# EAGLE design PCB2 (EAGLE 7.5.0)
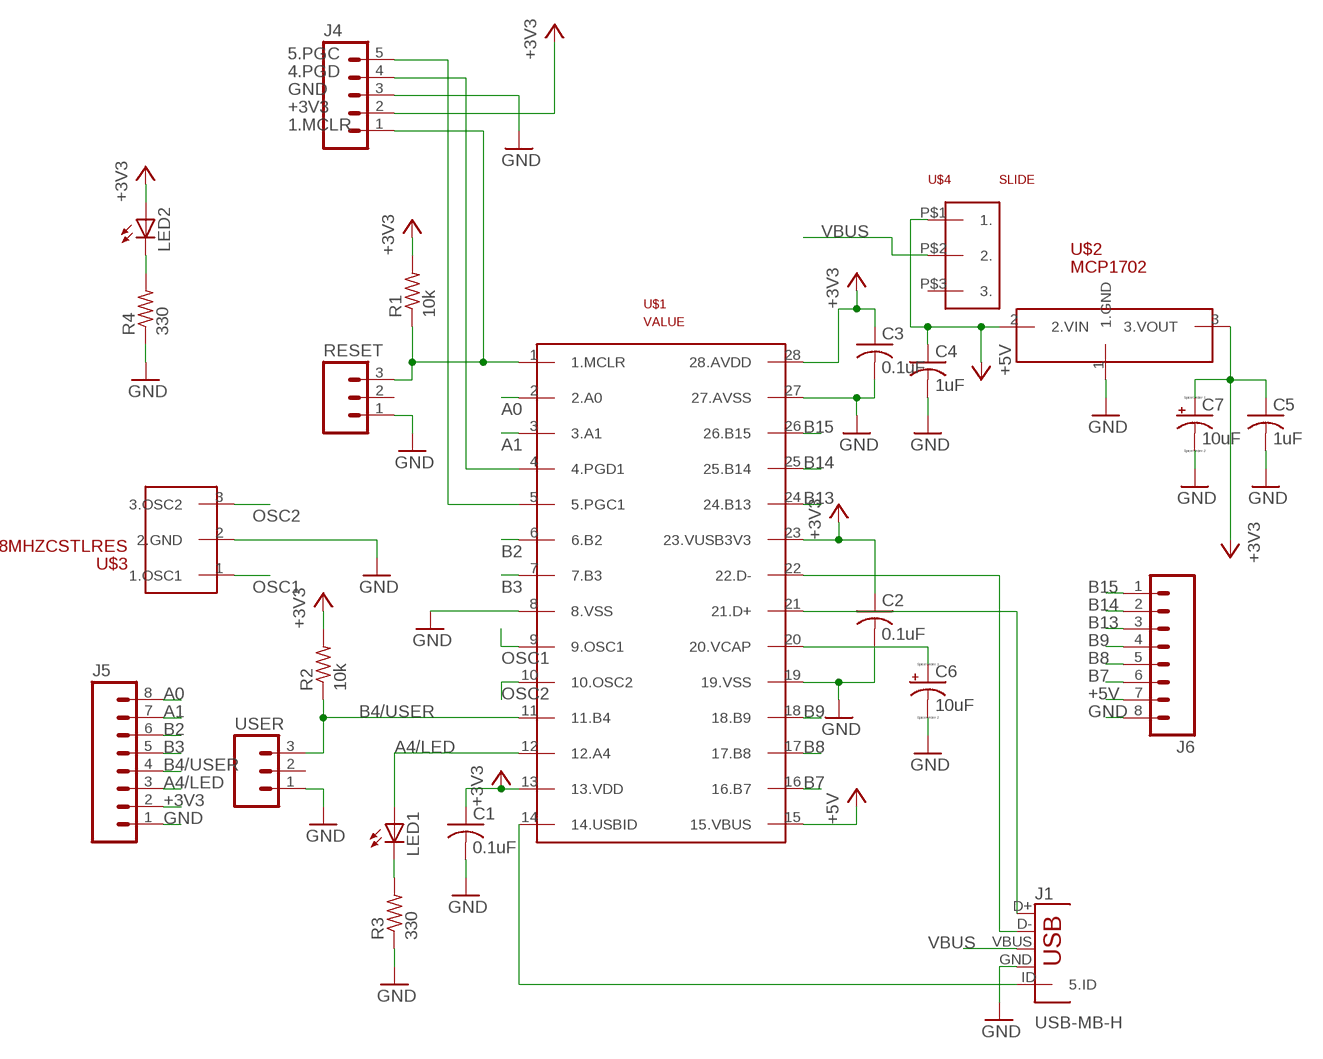
[diagram p0: schematic, sheet 1]

## Parts
C1  0.1uF  C-US025-024X044  [C025-024X044]
C2  0.1uF  C-US025-024X044  [C025-024X044]
C3  0.1uF  C-US025-024X044  [C025-024X044]
C4  1uF  C-US050-024X044  [C050-024X044]
C5  1uF  C-US050-024X044  [C050-024X044]
C6  10uF  CPOL-USTAP5-50  [TAP5-50]
C7  10uF  CPOL-USTAP5-50  [TAP5-50]
J1  USB-MB-H  [USB-MB-H]
J4  M05PTH  [1X05]
J5  M08  [1X08_ROUND]
J6  M08  [1X08_ROUND]
LED1  LED3MM  [LED3MM]
LED2  LED3MM  [LED3MM]
R1  10k  R-US_0207/10  [0207/10]
R2  10k  R-US_0207/10  [0207/10]
R3  330  R-US_0207/10  [0207/10]
R4  330  R-US_0207/10  [0207/10]
RESET  M03PTH  [1X03]
U$1  PIC32MX250F128B  [DIL28-3]
U$2  MCP1702  [TO92]
U$3  8MHZCSTLRES  [1X03]
U$4  SLIDE  [SLIDE]
USER  M03PTH  [1X03]

## Nets
1.MCLR: J4.1 R1.1 RESET.3 U$1.1(1.MCLR)
4.PGD: J4.4 U$1.4(4.PGD1)
5.PGC: J4.5 U$1.5(5.PGC1)
+3V3: C1.1 C2.1 C3.1 C5.1 C7.+ J4.2 J5.2 LED2.A R1.2 R2.2 U$1.13(13.VDD) U$1.23(23.VUSB3V3) U$1.28(28.AVDD) U$2.3(3.VOUT)
+5V: C4.1 J6.7 U$1.15(15.VBUS) U$2.2(2.VIN) U$4.P$1(1.)
A0: J5.8 U$1.2(2.A0)
A1: J5.7 U$1.3(3.A1)
A4/LED: J5.3 LED1.A U$1.12(12.A4)
B2: J5.6 U$1.6(6.B2)
B3: J5.5 U$1.7(7.B3)
B4/USER: J5.4 R2.1 U$1.11(11.B4) USER.3
B7: J6.6 U$1.16(16.B7)
B8: J6.5 U$1.17(17.B8)
B9: J6.4 U$1.18(18.B9)
B13: J6.3 U$1.24(24.B13)
B14: J6.2 U$1.25(25.B14)
B15: J6.1 U$1.26(26.B15)
GND: C1.2 C2.2 C3.2 C4.2 C5.2 C6.- C7.- J1.GND J4.3 J5.1 J6.8 R3.1 R4.1 RESET.1 U$1.8(8.VSS) U$1.19(19.VSS) U$1.27(27.AVSS) U$2.1(1.GND) U$3.2(2.GND) USER.1
N$2: LED1.K(C) R3.2
N$3: J1.ID(5.ID) U$1.14(14.USBID)
N$7: J1.D- U$1.22(22.D-)
N$8: J1.D+ U$1.21(21.D+)
N$10: C6.+ U$1.20(20.VCAP)
N$11: LED2.K(C) R4.2
OSC1: U$1.9(9.OSC1) U$3.1(1.OSC1)
OSC2: U$1.10(10.OSC2) U$3.3(3.OSC2)
VBUS: J1.VBUS U$4.P$2(2.)
Unconnected: RESET.2 U$4.P$3(3.) USER.2

## Library data of the parts
C1-C5 = PCB:C-US: CAPACITOR, American symbol
C6 C7 = PCB:CPOL-US: POLARIZED CAPACITOR, American symbol
J1 = PCB:USB: USB Connectors USB-B-PTH is fully proven SKU : PRT-00139/CONN-08278 USB-miniB is fully proven SKU : PRT-00587 USB-A-PCB is untested. USB-A-H is throughly reviewed, but untested. Spark Fun Electronics SKU : PRT-00437 USB-B-SMT is throughly reviewed, but untested. Needs silkscreen touching up. USB-A-S has not been used/tested USB-MB-H has not been used/tested USB-MICROB has been used. CONN-09505
J4 = PCB:M05: Header 5 Standard 5-pin 0.1" header. Use with straight break away headers (SKU : PRT-00116), right angle break away headers (PRT-00553), swiss pins (PRT-00743), machine pins (PRT-00117), and female headers (PRT-00115). Molex polarized connector foot print use with SKU : PRT-08230 with associated crimp pins and housings.
J5 J6 = PCB:M08: Header 8 Standard 8-pin 0.1" header. Use with straight break away headers (SKU : PRT-00116), right angle break away headers (PRT-00553), swiss pins (PRT-00743), machine pins (PRT-00117), and female headers (PRT-00115).; PROD_ID: CONN-08437
LED1 LED2 = PCB:LED: LED OSRAM: - CHIPLED LG R971, LG N971, LY N971, LG Q971, LY Q971, LO R971, LY R971 LH N974, LH R974 LS Q976, LO Q976, LY Q976 LO Q996 - Hyper CHIPLED LW Q18S LB Q993, LB Q99A, LB R99A - SideLED LS A670, LO A670, LY A670, LG A670, LP A670 LB A673, LV A673, LT A673, LW A673 LH A674 LY A675 LS A676, LA A676, LO A676, LY A676, LW A676 LS A679, LY A679, LG A679 - Hyper Micro SIDELED® LS Y876, LA Y876, LO Y876, LY Y876 LT Y87S - SmartLED LW L88C, LW L88S LB L89C, LB L89S, LG L890 LS L89K, LO L89K, LY L89K LS L896, LA L896, LO L896, LY L896 - TOPLED LS T670, LO T670, LY T670, LG T670, LP T670 LSG T670, LSP T670, LSY T670, LOP T670, LYG T670 LG T671, LOG T671, LSG T671 LB T673, LV T673, LT T673, LW T673 LH T674 LS T676, LA T676, LO T676, LY T676, LB T676, LH T676, LSB T676, LW T676 LB T67C, LV T67C, LT T67C, LS T67K, LO T67K, LY T67K, LW E67C LS E67B, LA E67B, LO E67B, LY E67B, LB E67C, LV E67C, LT E67C LW T67C LS T679, LY T679, LG T679 LS T770, LO T770, LY T770, LG T770, LP T770 LB T773, LV T773, LT T773, LW T773 LH T774 LS E675, LA E675, LY E675, LS T675 LS T776, LA T776, LO T776, LY T776, LB T776 LHGB T686 LT T68C, LB T68C - Hyper Mini TOPLED® LB M676 - Mini TOPLED Santana® LG M470 LS M47K, LO M47K, LY M47K Source: http://www.osram.convergy.de LUXEON: - LUMILED® LXK2-PW12-R00, LXK2-PW12-S00, LXK2-PW14-U00, LXK2-PW14-V00 LXK2-PM12-R00, LXK2-PM12-S00, LXK2-PM14-U00 LXK2-PE12-Q00, LXK2-PE12-R00, LXK2-PE12-S00, LXK2-PE14-T00, LXK2-PE14-U00 LXK2-PB12-K00, LXK2-PB12-L00, LXK2-PB12-M00, LXK2-PB14-N00, LXK2-PB14-P00, LXK2-PB14-Q00 LXK2-PR12-L00, LXK2-PR12-M00, LXK2-PR14-Q00, LXK2-PR14-R00 LXK2-PD12-Q00, LXK2-PD12-R00, LXK2-PD12-S00 LXK2-PH12-R00, LXK2-PH12-S00 LXK2-PL12-P00, LXK2-PL12-Q00, LXK2-PL12-R00 Source: www.luxeon.com KINGBRIGHT: KA-3528ASYC Source: www.kingbright.com
R1-R4 = PCB:R-US_: RESISTOR, American symbol
RESET USER = PCB:M03: Header 3 Standard 3-pin 0.1" header. Use with straight break away headers (SKU : PRT-00116), right angle break away headers (PRT-00553), swiss pins (PRT-00743), machine pins (PRT-00117), and female headers (PRT-00115). Molex polarized connector foot print use with SKU : PRT-08232 with associated crimp pins and housings.
U$1 = PCB:PIC32MX250F128B
U$2 = PCB:MCP1702
U$3 = PCB:8MHZCSTLRES
U$4 = PCB:SLIDE

## Board
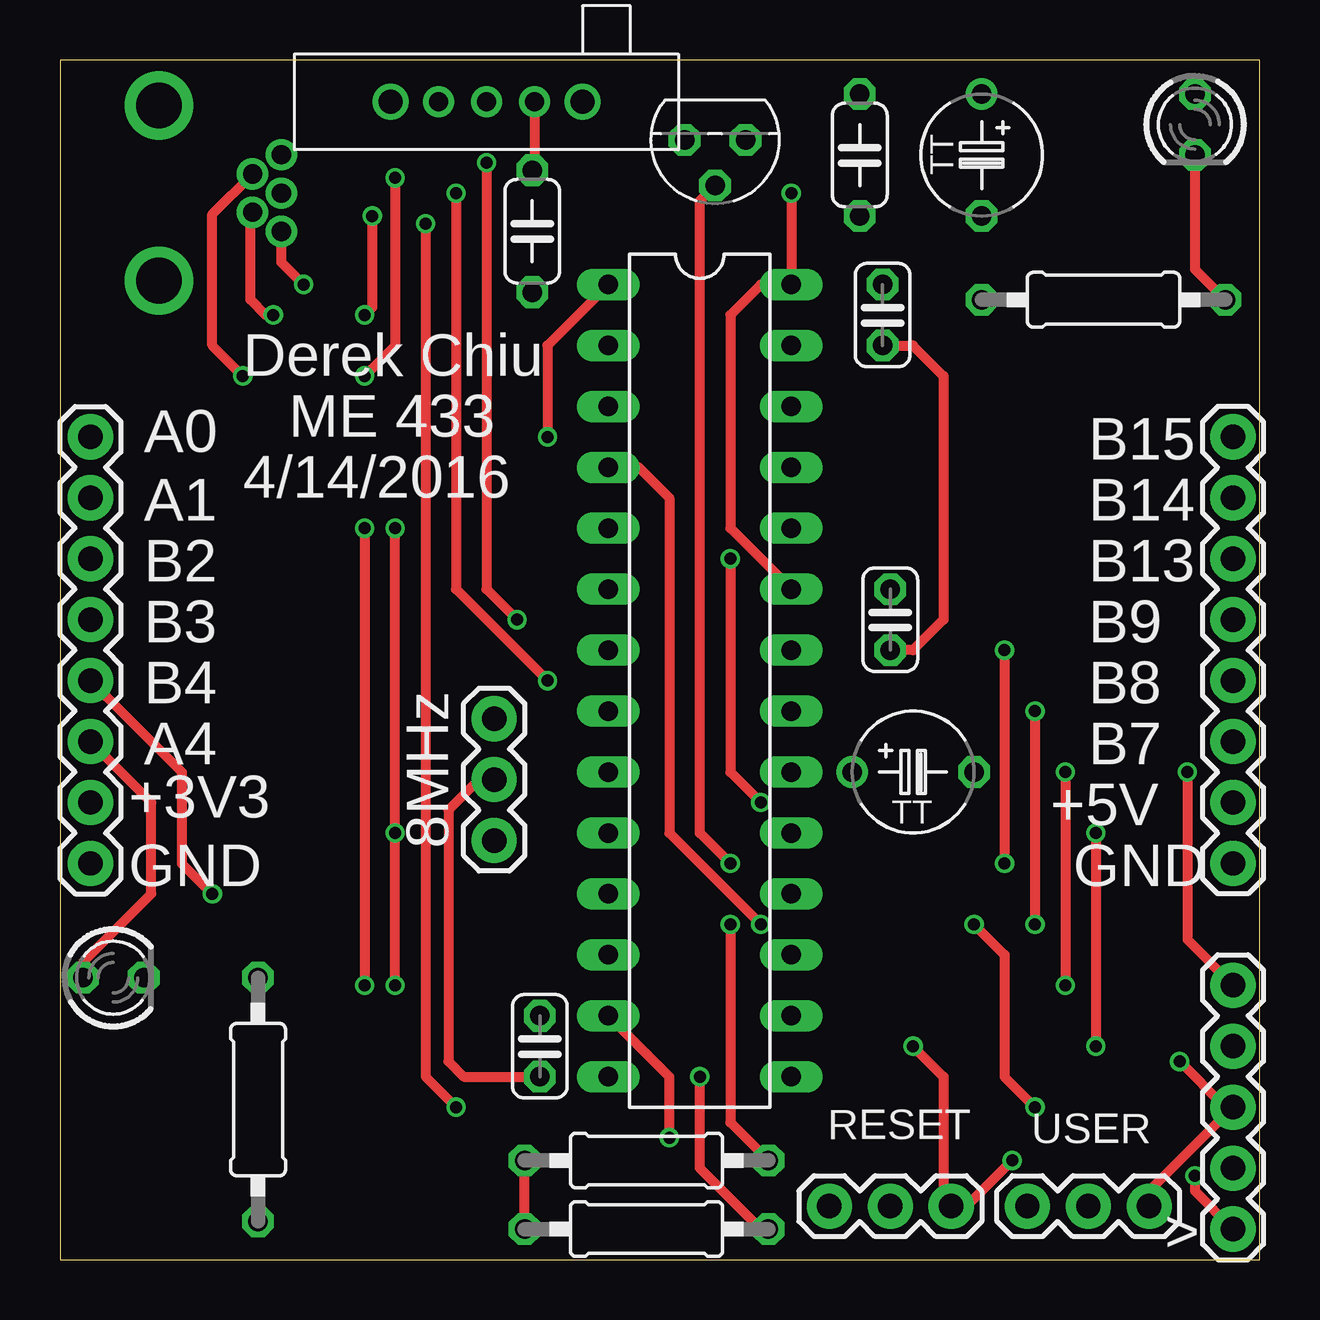
[diagram p1: board, top side]
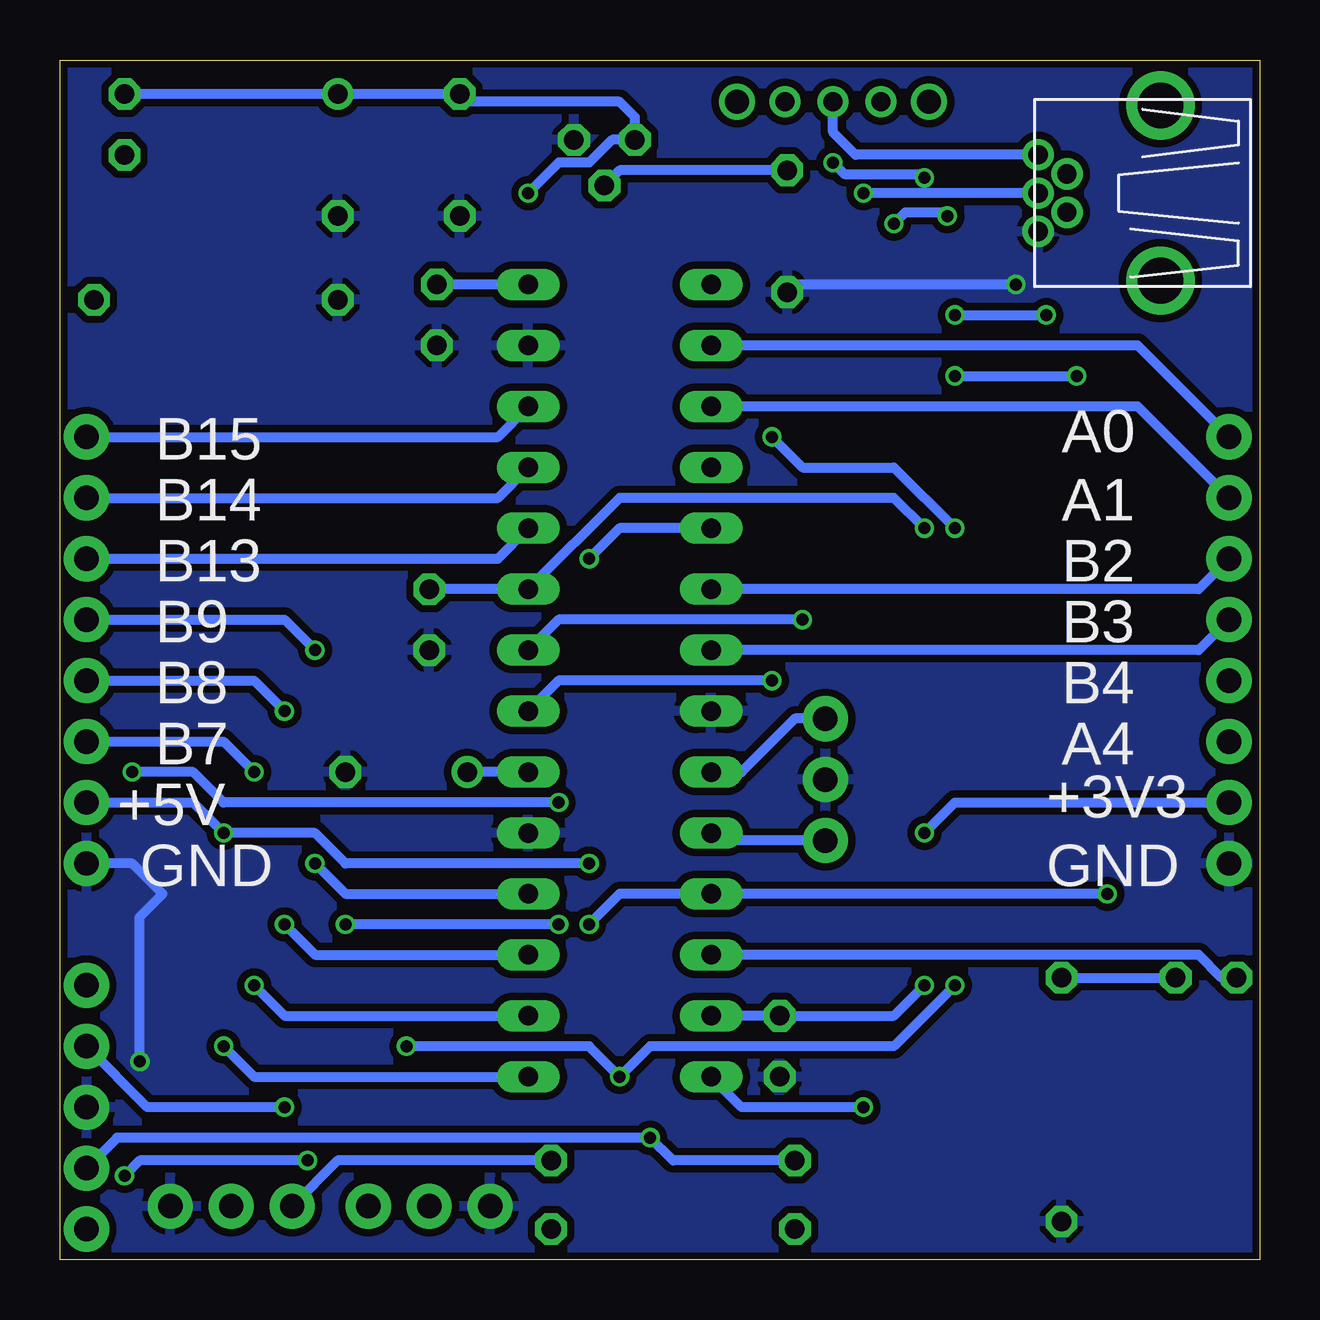
[diagram p2: board, bottom side, seen from below]

Size 50 x 50 mm. Coordinates in mm from the lower left corner, seen from the top.
Outline: 0,0 50,0 50,50 0,50 0,0
Copper layers (1*16): Top 0.035mm / dielectric 1.5mm / Bottom 0.035mm
Design rules "SeeedStudio_2layer_DRU_no_angle_20140221": minimum track width 6mil, minimum drill 12mil, track to track 6mil, track to pad 6mil, pad to pad 6mil, via to via 6mil, smd to smd 0mil, copper to edge 10mil, drill to drill 10mil, minimum pad ring 10mil, minimum via ring 6mil, stop-mask expansion 2mil, vias tented up to drill 100mil, thermal gap 10mil

### Footprints (pad centres in the part's own frame; a part is rotated, then mirrored left to right if it is on the bottom)
C025-024X044 = drill 0.813 octagon: 1 -1.27,0; 2 1.27,0
C050-024X044 = drill 0.813 octagon: 1 -2.54,0; 2 2.54,0
TAP5-50 = drill 0.813: + -2.54,0 | drill 0.813 octagon: - 2.54,0
USB-MB-H = drill 0.8: D+ 5.1,0; D- 3.9,0.8; GND 5.1,-1.6; ID 3.9,-0.8; VBUS 5.1,1.6 | drill 1.9: P$6 0,-3.65; P$7 0,3.65
1X05 = drill 1.016 pad 1.88: 1 0,0; 2 2.54,0; 3 5.08,0; 4 7.62,0; 5 10.16,0
1X08_ROUND = drill 1.016 pad 1.88: 1 0,0; 2 2.54,0; 3 5.08,0; 4 7.62,0; 5 10.16,0; 6 12.7,0; 7 15.24,0; 8 17.78,0
LED3MM = drill 0.813 octagon: A -1.27,0; K 1.27,0
0207/10 = drill 0.813 octagon: 1 -5.08,0; 2 5.08,0
1X03 = drill 1.016 pad 1.88: 1 0,0; 2 2.54,0; 3 5.08,0
DIL28-3 = drill 0.813 long: 1 -16.51,-3.81; 2 -13.97,-3.81; 3 -11.43,-3.81; 4 -8.89,-3.81; 5 -6.35,-3.81; 6 -3.81,-3.81; 7 -1.27,-3.81; 8 1.27,-3.81; 9 3.81,-3.81; 10 6.35,-3.81; 11 8.89,-3.81; 12 11.43,-3.81; 13 13.97,-3.81; 14 16.51,-3.81; 15 16.51,3.81; 16 13.97,3.81; 17 11.43,3.81; 18 8.89,3.81; 19 6.35,3.81; 20 3.81,3.81; 21 1.27,3.81; 22 -1.27,3.81; 23 -3.81,3.81; 24 -6.35,3.81; 25 -8.89,3.81; 26 -11.43,3.81; 27 -13.97,3.81; 28 -16.51,3.81
TO92 = drill 0.813 octagon: 1 -1.27,0; 2 0,1.905; 3 1.27,0
SLIDE = drill 0.8: P$1 -2,0; P$2 0,0; P$3 2,0 | drill 1: P$4 4,0; P$5 -4,0

### Placement (x,y rotation side)
C1  20,8.89 270 top
C2  34.61,26.67 270 top
C3  34.29,39.37 270 top
C4  19.68,42.86 270 top
C5  33.34,46.04 270 top
C6  35.56,20.32 0 top
C7  38.42,46.04 270 top
J1  4.13,44.45 0 top
J4  48.9,1.27 90 top
J5  1.27,16.51 90 top
J6  48.9,34.29 270 top
LED1  2.22,11.75 0 top
LED2  47.31,47.31 270 top
R1  24.45,1.27 180 top
R2  24.45,4.13 180 top
R3  8.26,6.67 90 top
R4  43.5,40.01 0 top
RESET  32.07,2.22 0 top
U$1  26.67,24.13 270 top
U$2  27.3,46.67 180 top
U$3  18.1,22.54 270 top
U$4  17.78,48.26 180 top
USER  45.4,2.22 180 top

### Tracks (layer width: path | path; a pad name or v marks a point on that pad's centre or on a via)
1.MCLR  (via drill 0.5)
  Top 0.406: R1.1 29.21,1.27 26.67,3.81 v26.67,7.62 | v35.56,8.89 36.83,7.62 36.83,2.54 RESET.3 37.78,2.22 v39.69,4.13 | v47.31,3.49 47.31,2.86 J4.1 | U$1.1 20.32,38.1 v20.32,34.29 | v12.7,30.48 v12.7,11.43
  Bottom 0.406: v35.56,8.89 27.94,8.89 v26.67,7.62 25.4,8.89 15.24,8.89 v12.7,11.43 | v39.69,4.13 46.67,4.13 v47.31,3.49 | v20.32,34.29 19.05,33.02 15.24,33.02 v12.7,30.48
4.PGD  (via drill 0.5)
  Top 0.406: U$1.4 24.13,33.02 25.4,31.75 25.4,17.78 v29.21,13.97 | v38.1,13.97 39.37,12.7 39.37,7.62 v40.64,6.35
  Bottom 0.406: v29.21,13.97 v38.1,13.97 | v40.64,6.35 46.35,6.35 J4.4
5.PGC  (via drill 0.5)
  Top 0.406: v27.94,29.21 27.94,20.32 v29.21,19.05 | v46.99,20.32 46.99,13.34 J4.5
  Bottom 0.406: U$1.5 26.67,30.48 v27.94,29.21 | v29.21,19.05 43.18,19.05 44.45,20.32 v46.99,20.32
+3V3  (via drill 0.5)
  Top 0.406: v30.48,44.45 U$1.28 29.21,40.64 27.94,39.37 27.94,30.48 U$1.23 | v13.97,11.43 v13.97,17.78 v13.97,30.48 | R1.2 R2.2 | v25.4,5.08 25.4,7.62 U$1.13
  Bottom 0.406: LED2.A C7.+ C5.1 33.02,48.26 26.67,48.26 26.04,47.62 U$2.3 26.99,46.67 27.94,45.72 29.21,45.72 v30.48,44.45 | U$1.28 C3.1 | C2.1 U$1.23 26.67,31.75 15.24,31.75 v13.97,30.48 | U$1.13 C1.1 15.24,10.16 v13.97,11.43 | v13.97,17.78 12.7,19.05 J5.2 | R2.2 24.45,4.13 v25.4,5.08 47.62,5.08 J4.2
+5V  (via drill 0.5)
  Top 0.406: v43.18,17.78 v43.18,8.89 | v27.94,16.51 26.67,17.78 26.67,44.13 U$2.2 | U$4.P$1 19.78,45.5 C4.1
  Bottom 0.406: J6.7 44.45,19.05 v43.18,17.78 39.37,17.78 38.1,16.51 v27.94,16.51 | v43.18,8.89 41.91,7.62 U$1.15 | C4.1 26.67,45.4 U$2.2
A0
  Bottom 0.406: J5.8 5.08,38.1 U$1.2
A1
  Bottom 0.406: J5.7 5.08,35.56 U$1.3
A4/LED
  Top 0.406: LED1.A 0.95,12.38 3.81,15.24 3.81,19.05 J5.3
  Bottom 0.406: LED1.A 1.59,11.75 2.54,12.7 U$1.12
B2
  Bottom 0.406: J5.6 2.54,27.94 U$1.6
B3
  Bottom 0.406: J5.5 2.54,25.4 U$1.7
B4/USER  (via drill 0.5)
  Top 0.406: J5.4 5.08,20.32 5.08,16.51 v6.35,15.24 | v27.94,13.97 27.94,5.71 R2.1
  Bottom 0.406: v6.35,15.24 U$1.11 26.67,15.24 v27.94,13.97 | R2.1 38.42,4.13 USER.3
B7  (via drill 0.5)
  Top 0.406: v41.91,20.32 v41.91,11.43
  Bottom 0.406: J6.6 43.18,21.59 v41.91,20.32 | v41.91,11.43 40.64,10.16 U$1.16
B8  (via drill 0.5)
  Top 0.406: v40.64,22.86 v40.64,13.97
  Bottom 0.406: J6.5 41.91,24.13 v40.64,22.86 | v40.64,13.97 39.37,12.7 U$1.17
B9  (via drill 0.5)
  Top 0.406: v39.37,25.4 v39.37,16.51
  Bottom 0.406: J6.4 40.64,26.67 v39.37,25.4 | v39.37,16.51 38.1,15.24 U$1.18
B13
  Bottom 0.406: J6.3 31.75,29.21 U$1.24
B14
  Bottom 0.406: J6.2 31.75,31.75 U$1.25
B15
  Bottom 0.406: J6.1 31.75,34.29 U$1.26
GND  (via drill 0.5)
  Top 0.406: J1.GND 9.23,41.57 v10.16,40.64 | U$3.2 17.46,20 16.19,18.73 16.19,8.26 16.83,7.62 C1.2 | USER.1 45.4,2.86 J4.3 48.58,6.35 v46.67,8.26 | C3.2 35.56,38.1 36.83,36.83 36.83,26.67 35.56,25.4 C2.2
  Bottom 0.406: v10.16,40.64 19.37,40.64 C4.2 | v46.67,8.26 46.67,14.29 45.72,15.24 46.99,16.51 J6.8
  pour Bottom (isolate 0.305): 0,49.53 0,0 50.8,0 50.8,1.27 50.8,49.53
N$2
  Bottom 0.406: R3.2 LED1.K
N$3  (via drill 0.5)
  Top 0.406: v15.24,43.18 15.24,7.62 v16.51,6.35 | v13.02,43.5 13.02,39.69 v12.7,39.37 | v8.89,39.37 8.57,39.37 7.94,40.01 7.94,43.56 J1.ID
  Bottom 0.406: v16.51,6.35 21.59,6.35 U$1.14 | v15.24,43.18 14.77,43.65 13.17,43.65 v13.02,43.5 | v12.7,39.37 v8.89,39.37
N$7  (via drill 0.5)
  Top 0.406: v17.78,45.72 17.78,27.94 v19.05,26.67 | v13.97,45.09 13.97,38.1 v12.7,36.83 | v7.62,36.83 6.35,38.1 6.35,43.57 J1.D-
  Bottom 0.406: v19.05,26.67 29.21,26.67 U$1.22 | v17.78,45.72 17.31,45.25 14.13,45.25 v13.97,45.09 | v12.7,36.83 v7.62,36.83
N$8  (via drill 0.5)
  Top 0.406: v16.51,44.45 16.51,27.94 v20.32,24.13
  Bottom 0.406: v20.32,24.13 29.21,24.13 U$1.21 | J1.D+ v16.51,44.45
N$10
  Bottom 0.406: U$1.20 C6.+
N$11
  Top 0.406: LED2.K 47.31,41.27 R4.2
OSC1
  Bottom 0.406: U$3.1 19.37,22.54 21.59,20.32 U$1.9
OSC2
  Bottom 0.406: U$3.3 22.54,17.46 U$1.10
VBUS
  Bottom 0.406: J1.VBUS 16.84,46.05 17.78,46.99 U$4.P$2

### Text on the board
tPlace: Derek Chiu | A0 | ME 433 | B15 | 4/14/2016 | A1 | B14 | B2 | B13 | B3 | B9 | B4 | B8 | A4 | B7 | +3V3 | +5V | 8MHz | GND | GND | >
bPlace: A0 | B15 | A1 | B14 | B2 | B13 | B3 | B9 | B4 | B8 | A4 | B7 | +3V3 | +5V | GND | GND